# EAGLE design cec-wifi-bridge-rev-a (EAGLE 7.3.0)

## Sheet 1 of 4
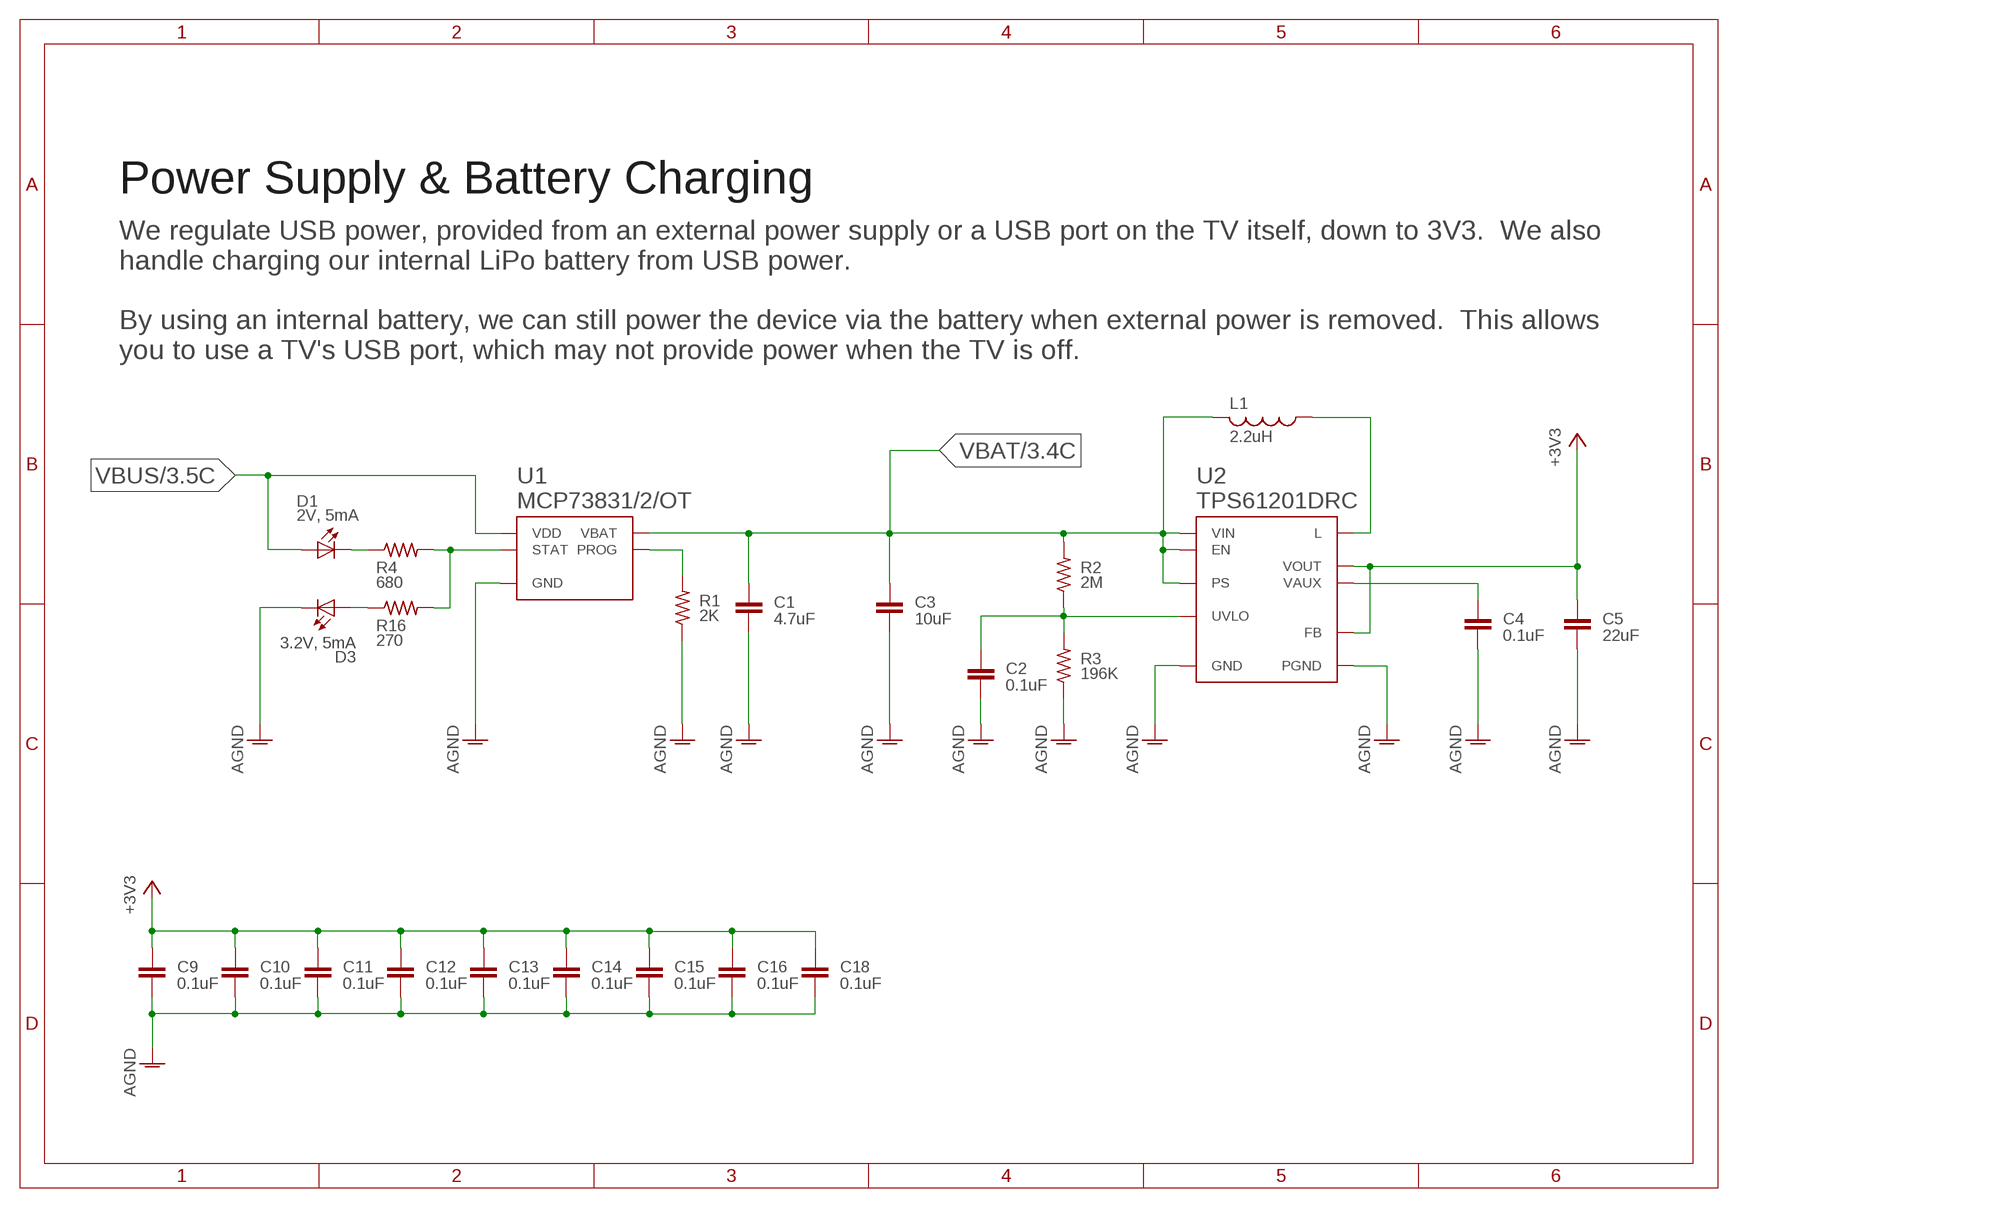
[diagram p0: schematic, sheet 1]
SHEET1 (A4L-NODOC): BOM: EXCLUDE

### Parts
C1  4.7uF  CAPACITOR-0603  [C0603]
C2  0.1uF  CAPACITOR-0402  [C0402]
C3  10uF  CAPACITOR-0805  [C0805]
C4  0.1uF  CAPACITOR-0402  [C0402]
C5  22uF  CAPACITOR-0805  [C0805]
C9  0.1uF  CAPACITOR-0402  [C0402]
C10  0.1uF  CAPACITOR-0402  [C0402]
C11  0.1uF  CAPACITOR-0402  [C0402]
C12  0.1uF  CAPACITOR-0402  [C0402]
C13  0.1uF  CAPACITOR-0402  [C0402]
C14  0.1uF  CAPACITOR-0402  [C0402]
C15  0.1uF  CAPACITOR-0402  [C0402]
C16  0.1uF  CAPACITOR-0402  [C0402]
C18  0.1uF  CAPACITOR-0402  [C0402]
D1  2V, 5mA  DIALIGHT-598-MICROSMD-0603  [DIALIGHT-0603]
D3  3.2V, 5mA  DIALIGHT-598-MICROSMD-0603  [DIALIGHT-0603]
L1  2.2uH  INDUCTOR-HORIZONTAL-XPL2010  [COILCRAFT-XPL2010]
R1  2K  RESISTOR-0402  [R0402]
R2  2M  RESISTOR-0402  [R0402]
R3  196K  RESISTOR-0402  [R0402]
R4  680  RESISTOR-HORIZONTAL-0603  [R0603]
R16  270  RESISTOR-HORIZONTAL-0603  [R0603]
U1  MCP73831/2/OT  [5-SOT23]
U2  TPS61201DRC  TPS61200DRC  [S-PVSON-N10-DRC]

### Nets
+3V3: C5.1 C9.1 C10.1 C11.1 C12.1 C13.1 C14.1 C15.1 C16.1 C18.1 U2.P$2(VOUT) U2.P$10(FB) ; also sheet 2,3,4
AGND: C1.2 C2.2 C3.2 C4.2 C5.2 C9.2 C10.2 C11.2 C12.2 C13.2 C14.2 C15.2 C16.2 C18.2 D3.2(C) R1.1 R3.1 U1.2(GND) U2.GND-VIA-1(PGND) U2.GND-VIA-2(PGND) U2.GND-VIA-3(PGND) U2.GND-VIA-4(PGND) U2.GND-VIA-5(PGND) U2.P$4(PGND) U2.P$9(GND) U2.THERMAL1(PGND) U2.THERMAL2(PGND) U2.THERMAL3(PGND) U2.THERMAL4(PGND) U2.THERMAL(PGND) ; also sheet 2,3,4
N$2: C4.1 U2.P$1(VAUX)
N$4: R1.2 U1.5(PROG)
N$5: D3.1(A) R16.1
N$6: C2.1 R2.1 R3.2 U2.P$7(UVLO)
N$7: R4.2 R16.2 U1.1(STAT)
N$8: D1.2(C) R4.1
N$9: L1.P$1 U2.P$3(L)
VBAT: C1.1 C3.1 L1.P$2 R2.2 U1.3(VBAT) U2.P$5(VIN) U2.P$6(EN) U2.P$8(PS) ; also sheet 3
VBUS: D1.1(A) U1.4(VDD) ; also sheet 3

### Notes on the sheet
- Power Supply & Battery Charging
- We regulate USB power, provided from an external power supply or a USB port on the TV itself, down to 3V3.  We also
  handle charging our internal LiPo battery from USB power.
  
  By using an internal battery, we can still power the device via the battery when external power is removed.  This allows
  you to use a TV's USB port, which may not provide power when the TV is off.

## Sheet 2 of 4
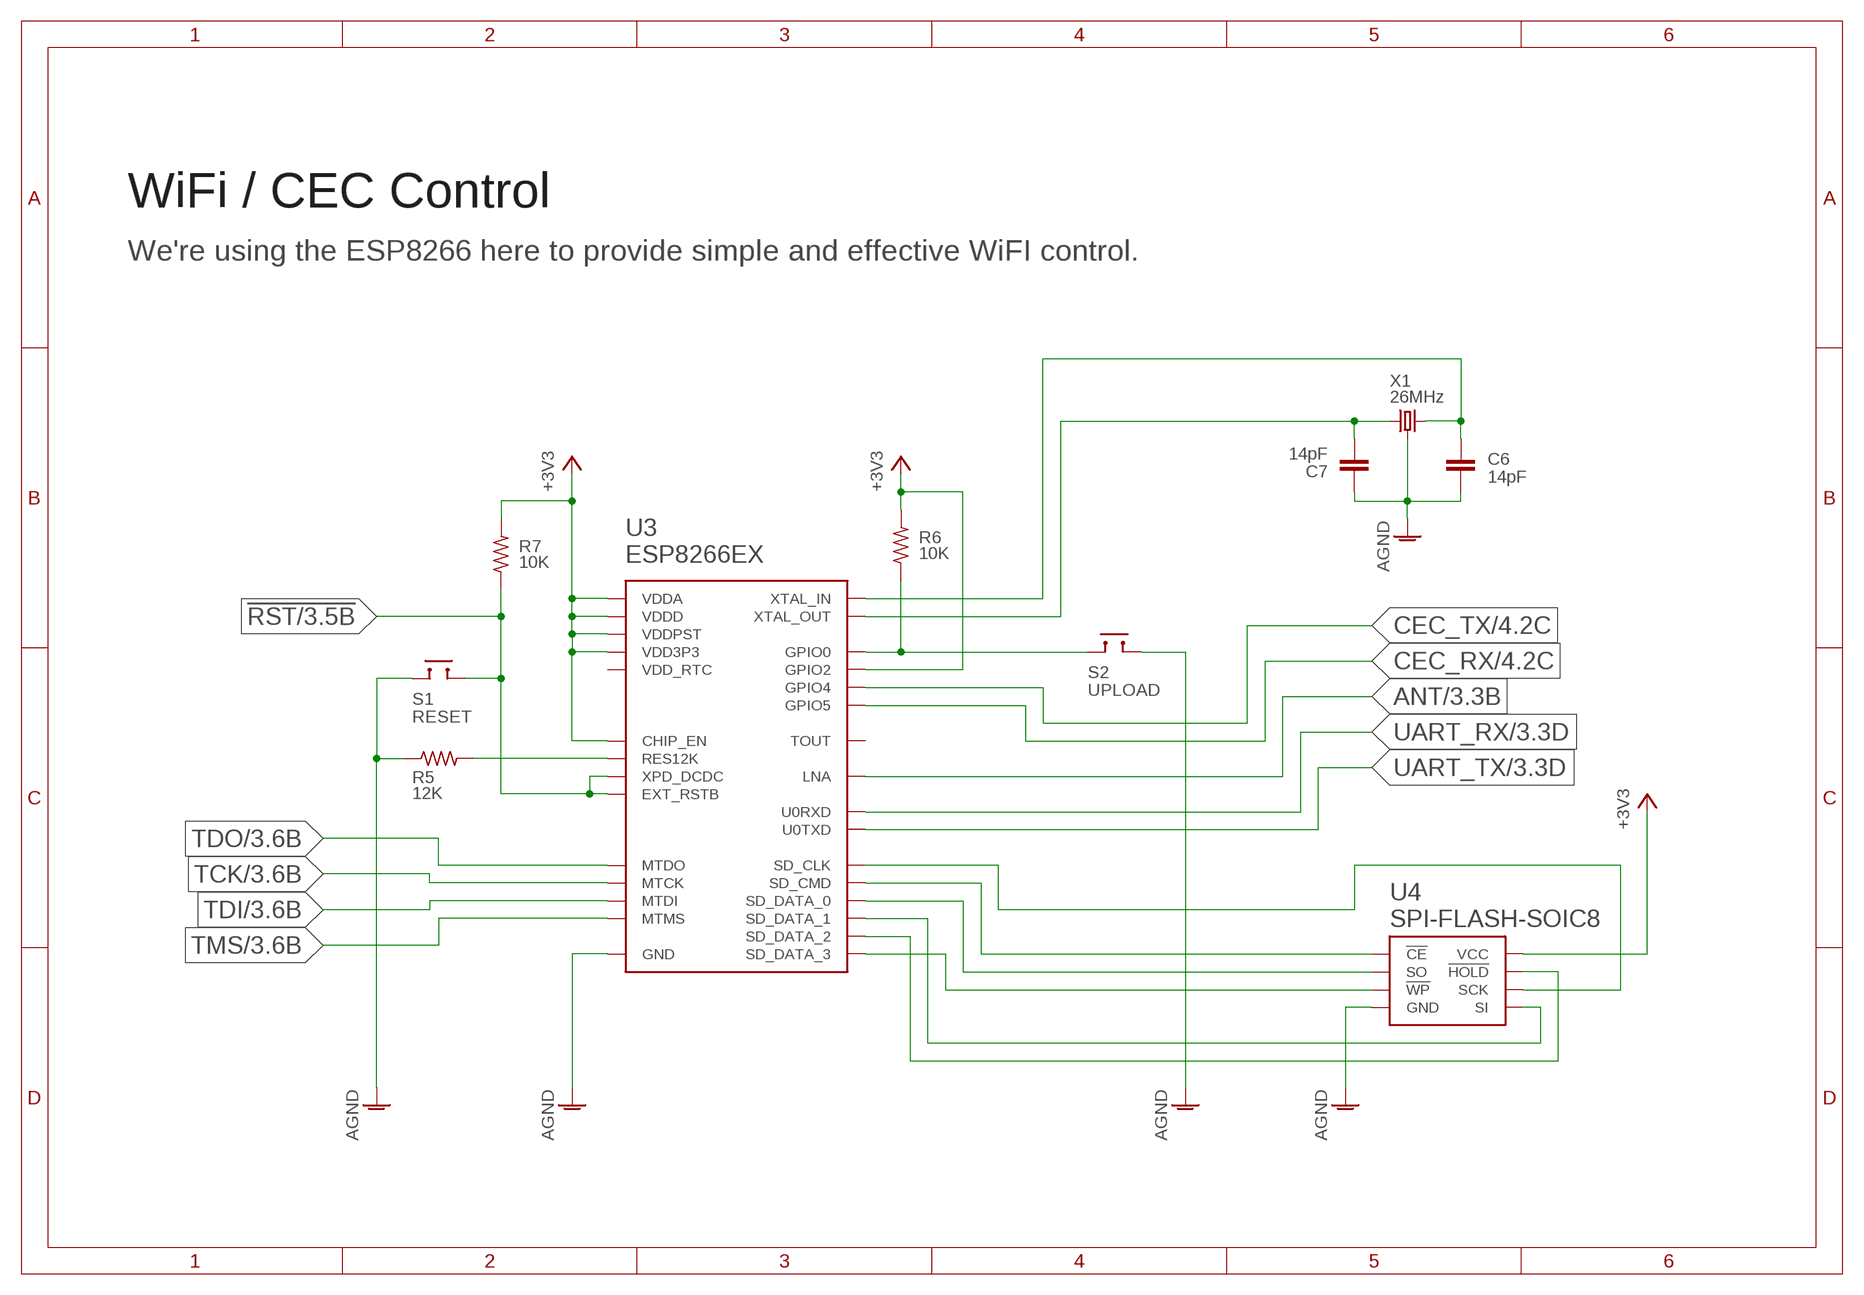
[diagram p1: schematic, sheet 2]
SHEET2 (A4L-NODOC): BOM: EXCLUDE

### Parts
C6  14pF  CAPACITOR-0402  [C0402]
C7  14pF  CAPACITOR-0402  [C0402]
R5  12K  RESISTOR-HORIZONTAL-0402  [R0402]
R6  10K  RESISTOR-0402  [R0402]
R7  10K  RESISTOR-0402  [R0402]
S1  RESET  MOMENTARY-ALPS-SKQG  [ALPS-SKQG]
S2  UPLOAD  MOMENTARY-ALPS-SKQG  [ALPS-SKQG]
U3  ESP8266EX  [ESP8266EX]
U4  SPI-FLASH-SOIC8  [SOIC-8]
X1  26MHz  GROUNDED-CRYSTAL-EPSON-TSX-3225  [EPSON-TSX-3225]

### Nets
!RST: R7.1 S1.P$3 S1.P$4 U3.EXT_RSTB U3.XPD_DCDC ; also sheet 3
+3V3: R6.2 R7.2 U3.CHIP_EN U3.GPIO2 U3.VDD3P3 U3.VDD3P3$2(VDD3P3) U3.VDDA U3.VDDA$2(VDDA) U3.VDDD U3.VDDPST U3.VDDPST$2(VDDPST) U4.P$8(VCC) ; also sheet 1,3,4
AGND: C6.2 C7.1 R5.1 S1.P$1 S1.P$2 S2.P$3 S2.P$4 U3.GND U3.P$1(GND) U3.P$2(GND) U3.P$3(GND) U3.P$4(GND) U3.P$5(GND) U3.P$6(GND) U3.P$7(GND) U3.P$8(GND) U3.P$9(GND) U4.P$4(GND) X1.P$2(GND) X1.P$4(GND) ; also sheet 1,3,4
ANT: U3.LNA ; also sheet 3
CEC_RX: U3.GPOIO5(GPIO5) ; also sheet 4
CEC_TX: U3.GPIO4 ; also sheet 4
FLASH_BOOT: R6.1 S2.P$1 S2.P$2 U3.GPIO0
N$10: R5.2 U3.RES12K
N$11: C6.1 U3.XTAL_IN X1.P$3
N$12: C7.2 U3.XTAL_OUT X1.P$1
N$20: U3.SD_CLK U4.P$6(SCK)
N$21: U3.SD_CMD U4.P$1(!CE)
N$22: U3.SD_DATA_1 U4.P$5(SI)
N$23: U3.SD_DATA_0 U4.P$2(SO)
N$24: U3.SD_DATA_3 U4.P$3(!WP)
N$25: U3.SD_DATA_2 U4.P$7(!HOLD)
TCK: U3.MTCK ; also sheet 3
TDI: U3.MTDI ; also sheet 3
TDO: U3.MTDO ; also sheet 3
TMS: U3.MTMS ; also sheet 3
UART_RX: U3.U0RXD ; also sheet 3
UART_TX: U3.U0TXD ; also sheet 3
Unconnected: U3.TOUT U3.VDD_RTC

### Notes on the sheet
- WiFi / CEC Control
- We're using the ESP8266 here to provide simple and effective WiFI control.

## Sheet 3 of 4
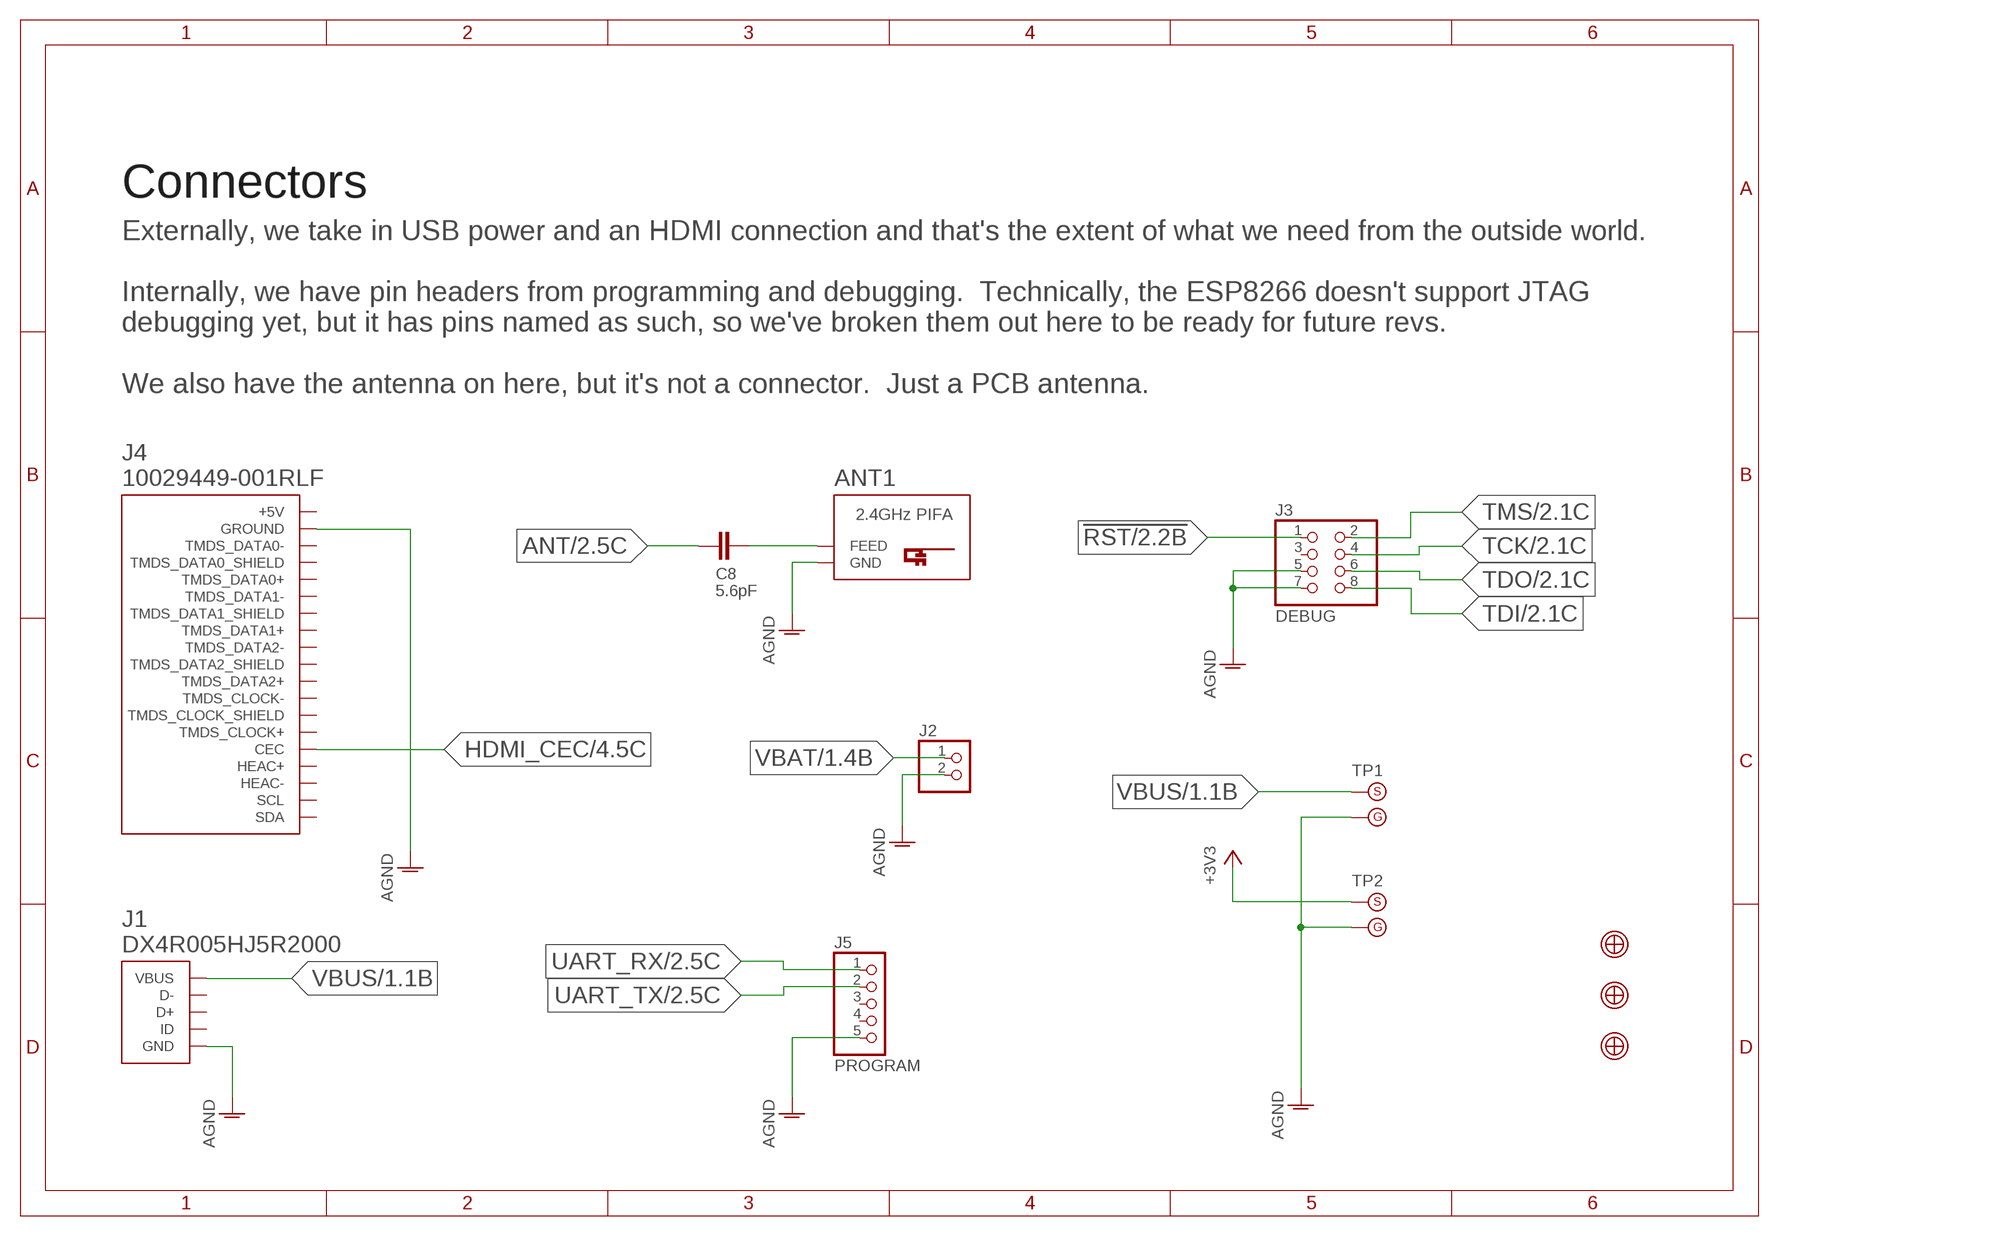
[diagram p2: schematic, sheet 3]
SHEET3 (A4L-NODOC): BOM: EXCLUDE

### Parts
ANT1  INVERTED_F_ANTENNA+0  [DN007+0]
C8  5.6pF  CAPACITOR-HORIZONTAL-0402  [C0402]
J1  DX4R005HJ5R2000  [DX4R005HJ5R2000]
J2  PINHD-1X2  [1X02]
J3  DEBUG  PINHD-2X4  [2X04]
J4  10029449-001RLF  [10029449]
J5  PROGRAM  PINHD-1X5  [1X05]
TP1  TESTPOINT-WITH-GND  [TESTPOINT-1.5-WITH-GND]
TP2  TESTPOINT-WITH-GND  [TESTPOINT-1.5-WITH-GND]
U$1  FIDUCIAL-1MM  [FIDUCIAL_1MM]
U$2  FIDUCIAL-1MM  [FIDUCIAL_1MM]
U$3  FIDUCIAL-1MM  [FIDUCIAL_1MM]

### Nets
!RST: J3.1 ; also sheet 2
+3V3: TP2.S ; also sheet 1,2,4
AGND: ANT1.GND ANT1.GND@1(GND) J1.5(GND) J1.CASE_1(GND) J1.CASE_2(GND) J1.CASE_3(GND) J1.CASE_4(GND) J2.2 J3.5 J3.7 J4.P$17(GROUND) J5.5 TP1.G TP2.G ; also sheet 1,2,4
ANT: C8.1 ; also sheet 2
HDMI_CEC: J4.P$13(CEC) ; also sheet 4
N$26: ANT1.FEED C8.2
TCK: J3.4 ; also sheet 2
TDI: J3.8 ; also sheet 2
TDO: J3.6 ; also sheet 2
TMS: J3.2 ; also sheet 2
UART_RX: J5.1 ; also sheet 2
UART_TX: J5.2 ; also sheet 2
VBAT: J2.1 ; also sheet 1
VBUS: J1.1(VBUS) TP1.S ; also sheet 1
Unconnected: J1.2(D-) J1.3(D+) J1.4(ID) J3.3 J4.P$1(TMDS_DATA2+) J4.P$2(TMDS_DATA2_SHIELD) J4.P$3(TMDS_DATA2-) J4.P$4(TMDS_DATA1+) J4.P$5(TMDS_DATA1_SHIELD) J4.P$6(TMDS_DATA1-) J4.P$7(TMDS_DATA0+) J4.P$8(TMDS_DATA0_SHIELD) J4.P$9(TMDS_DATA0-) J4.P$10(TMDS_CLOCK+) J4.P$11(TMDS_CLOCK_SHIELD) J4.P$12(TMDS_CLOCK-) J4.P$14(HEAC+) J4.P$15(SCL) J4.P$16(SDA) J4.P$18(+5V) J4.P$19(HEAC-) J5.3 J5.4

### Notes on the sheet
- Connectors
- Externally, we take in USB power and an HDMI connection and that's the extent of what we need from the outside world.
  
  Internally, we have pin headers from programming and debugging.  Technically, the ESP8266 doesn't support JTAG
  debugging yet, but it has pins named as such, so we've broken them out here to be ready for future revs.
  
  We also have the antenna on here, but it's not a connector.  Just a PCB antenna.

## Sheet 4 of 4
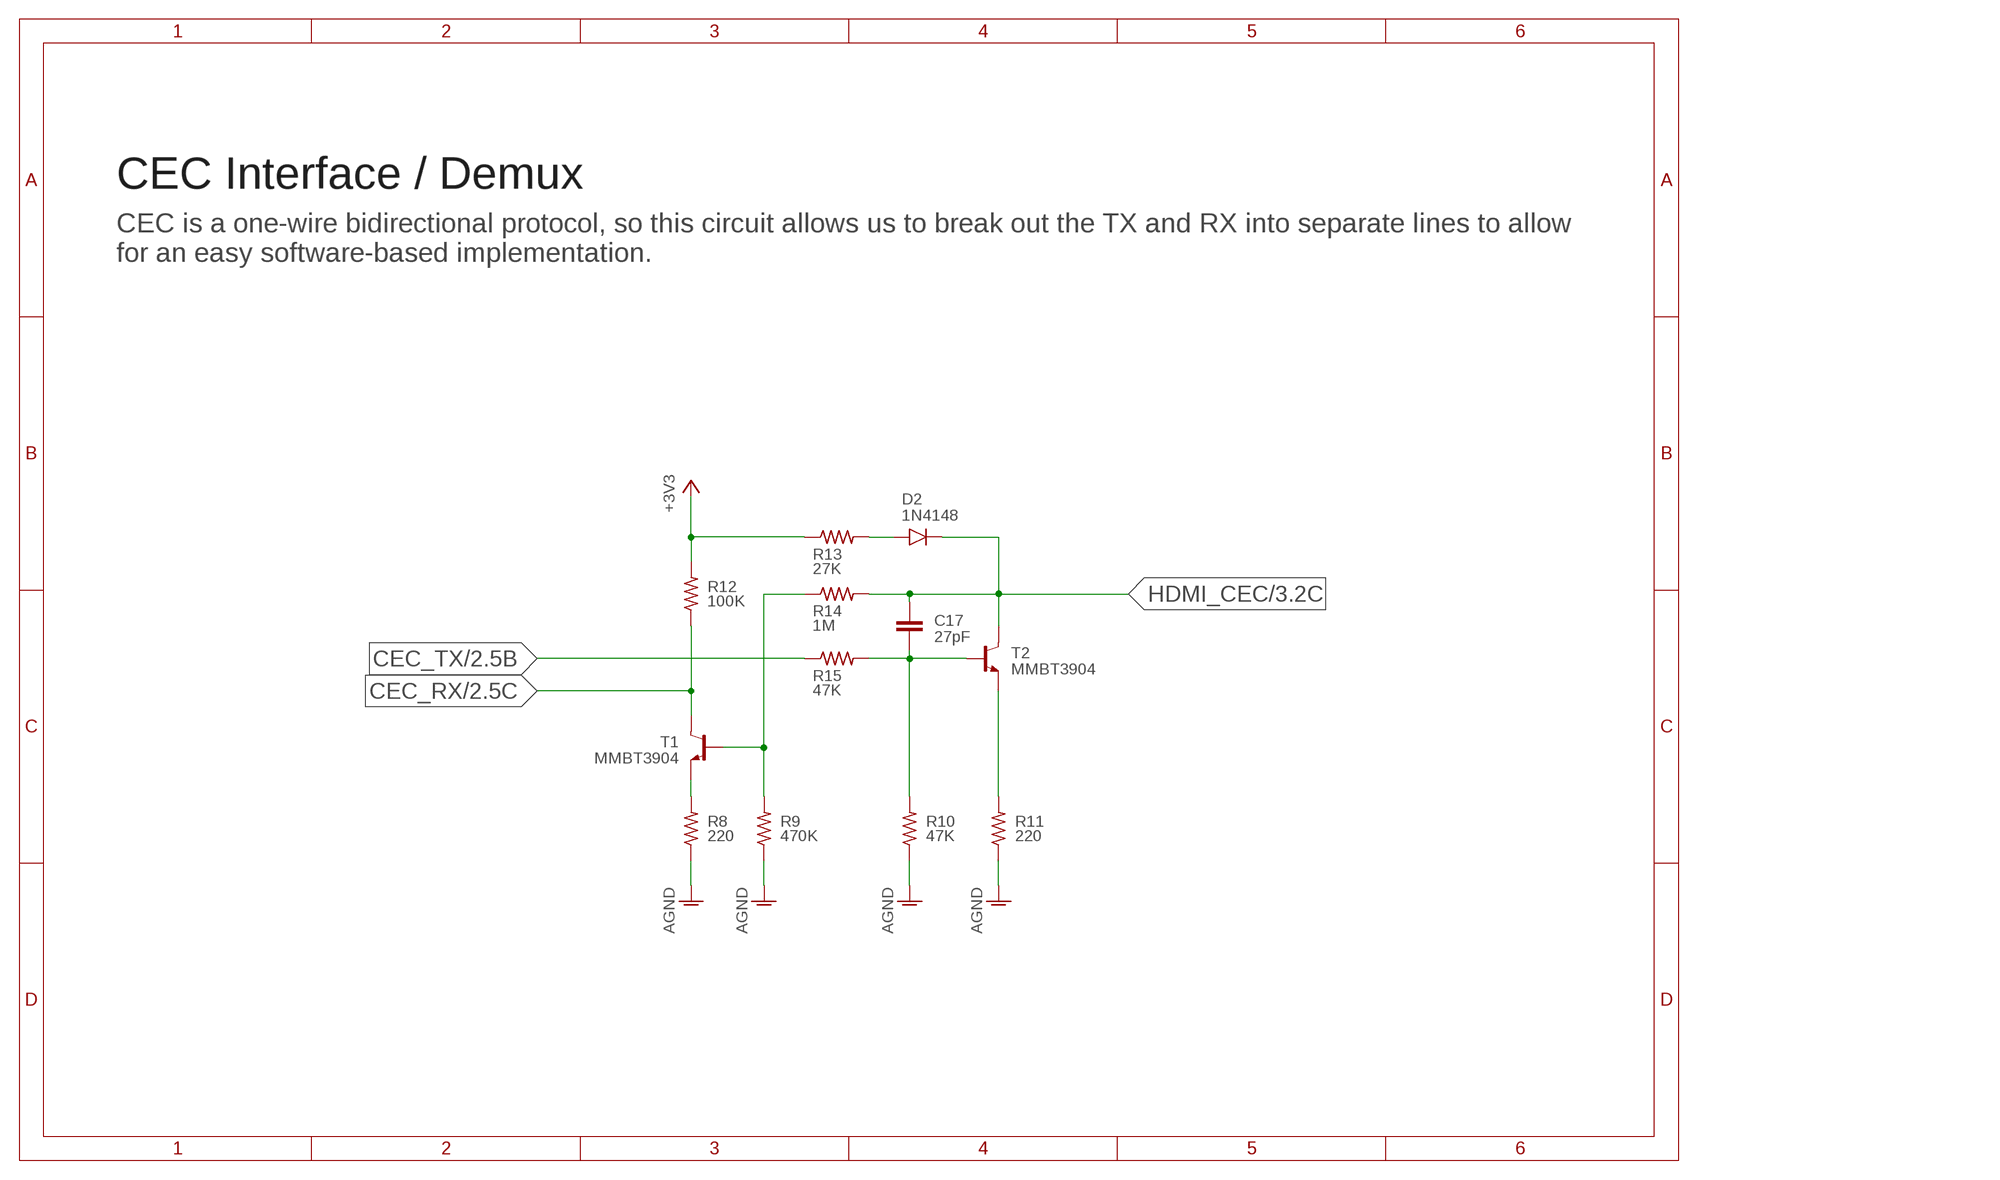
[diagram p3: schematic, sheet 4]
SHEET4 (A4L-NODOC): BOM: EXCLUDE

### Parts
C17  27pF  CAPACITOR-0402  [C0402]
D2  1N4148  DIODE-SOD123  [SOD123]
R8  220  RESISTOR-0402  [R0402]
R9  470K  RESISTOR-0402  [R0402]
R10  47K  RESISTOR-0402  [R0402]
R11  220  RESISTOR-0402  [R0402]
R12  100K  RESISTOR-0402  [R0402]
R13  27K  RESISTOR-HORIZONTAL-0402  [R0402]
R14  1M  RESISTOR-HORIZONTAL-0402  [R0402]
R15  47K  RESISTOR-HORIZONTAL-0402  [R0402]
T1  MMBT3904  BJT-NPN-SOT-23  [SOT-23]
T2  MMBT3904  BJT-NPN-SOT-23  [SOT-23]

### Nets
+3V3: R12.2 R13.1 ; also sheet 1,2,3
AGND: R8.1 R9.1 R10.1 R11.1 ; also sheet 1,2,3
CEC_RX: R12.1 T1.P$3(C) ; also sheet 2
CEC_TX: R15.1 ; also sheet 2
HDMI_CEC: C17.1 D2.C R14.2 T2.P$3(C) ; also sheet 3
N$3: C17.2 R10.2 R15.2 T2.P$1(B)
N$15: R8.2 T1.P$2(E)
N$16: R9.2 R14.1 T1.P$1(B)
N$18: D2.A R13.2
N$27: R11.2 T2.P$2(E)

### Notes on the sheet
- CEC Interface / Demux
- CEC is a one-wire bidirectional protocol, so this circuit allows us to break out the TX and RX into separate lines to allow
  for an easy software-based implementation.

## Library data of the parts
ANT1 = antenna:INVERTED_F_ANTENNA: 2.4GHz Inverted F Antenna Based on TI Design Note DN007; BOM: EXCLUDE
C1 = passives:CAPACITOR: Capacitor; PN: GRM188R61A475KE15D
C2 C4 C9-C16 C18 = passives:CAPACITOR: Capacitor; PN: GRM155R71H104KE14D
C3 = passives:CAPACITOR: Capacitor; PN: GRM21BR61A106KE19L
C5 = passives:CAPACITOR: Capacitor; PN: GRM21BR61A226ME51L
C6 C7 = passives:CAPACITOR: Capacitor; PN: GJM1555C1H140GB01D
C8 = passives:CAPACITOR-HORIZONTAL: Capacitor, horizontal; PN: GJM1555C1H5R6WB01D
C17 = passives:CAPACITOR: Capacitor; PN: GRM1555C1H270GA01D
D1 = dialight:DIALIGHT-598-MICROSMD; PN: APT1608SURCK
D2 = diodes:DIODE-: DIODE; PN: 1N4148W-7-F
D3 = dialight:DIALIGHT-598-MICROSMD; PN: 150060GS75000
J1 = jae:DX4R005HJ5R2000: USB Micro-B; PN: DX4R005HJ5R2000
J2 = pin-headers:PINHD-1X2: PIN HEADER; BOM: EXCLUDE
J3 = pin-headers:PINHD-2X4: PIN HEADER; PN: M20-9760446
J4 = amphenol:10029449: HDMI Type A Receptacle; PN: 10029449-001RLF
J5 = pin-headers:PINHD-1X5: PIN HEADER; PN: M20-9990546
L1 = passives:INDUCTOR-HORIZONTAL: INDUCTOR, American symbol; PN: XPL2010-222MLB
R1 = passives:RESISTOR; PN: RC0402FR-072KL
R2 = passives:RESISTOR; PN: RC0402FR-072ML
R3 = passives:RESISTOR; PN: RC0402FR-07196KL
R4 = passives:RESISTOR-HORIZONTAL; PN: RC0603FR-07680RL
R5 = passives:RESISTOR-HORIZONTAL; PN: RC0402FR-0712KL
R6 R7 = passives:RESISTOR; PN: RC0402FR-0710KL
R8 R11 = passives:RESISTOR; PN: RC0402FR-07220RL
R9 = passives:RESISTOR; PN: RC0402FR-07470KL
R10 = passives:RESISTOR; PN: RC0402FR-0747KL
R12 = passives:RESISTOR; PN: RC0402FR-07100KL
R13 = passives:RESISTOR-HORIZONTAL; PN: ERJ-2RKF2702X
R14 = passives:RESISTOR-HORIZONTAL; PN: RC0402FR-071ML
R15 = passives:RESISTOR-HORIZONTAL; PN: RC0402FR-0747KL
R16 = passives:RESISTOR-HORIZONTAL; PN: RC0603FR-07270RL
S1 S2 = switches:MOMENTARY; PN: SKQGADE010
T1 T2 = transistors:BJT-NPN; PN: MMBT3904LT1G
TP1 TP2 = test:TESTPOINT-WITH-GND; BOM: EXCLUDE
U1 = microchip:MCP73831/2: Miniature Single-Cell, Fully Integrated Li-Ion, Li-Polymer Charge Management Controllers; PN: MCP73831T-2ACI/OT
U2 = texas-instruments:TPS6120: LOW INPUT VOLTAGE SYNCHRONOUS BOOST CONVERTER WITH 1.3-A SWITCHES; PN: TPS61201DRCR
U3 = espressif:ESP8266EX; PN: ESP8266EX
U4 = flash:SPI-FLASH; PN: S25FL116K0XMFI041
U$1-U$3 = fiducials:FIDUCIAL: Fidicual Mark Used by pick-and-place machines to align and orient boards before loading components.; BOM: EXCLUDE
X1 = crystals:GROUNDED-CRYSTAL; PN: TSX-3225 26.0000MF09Z-AC3

## Board
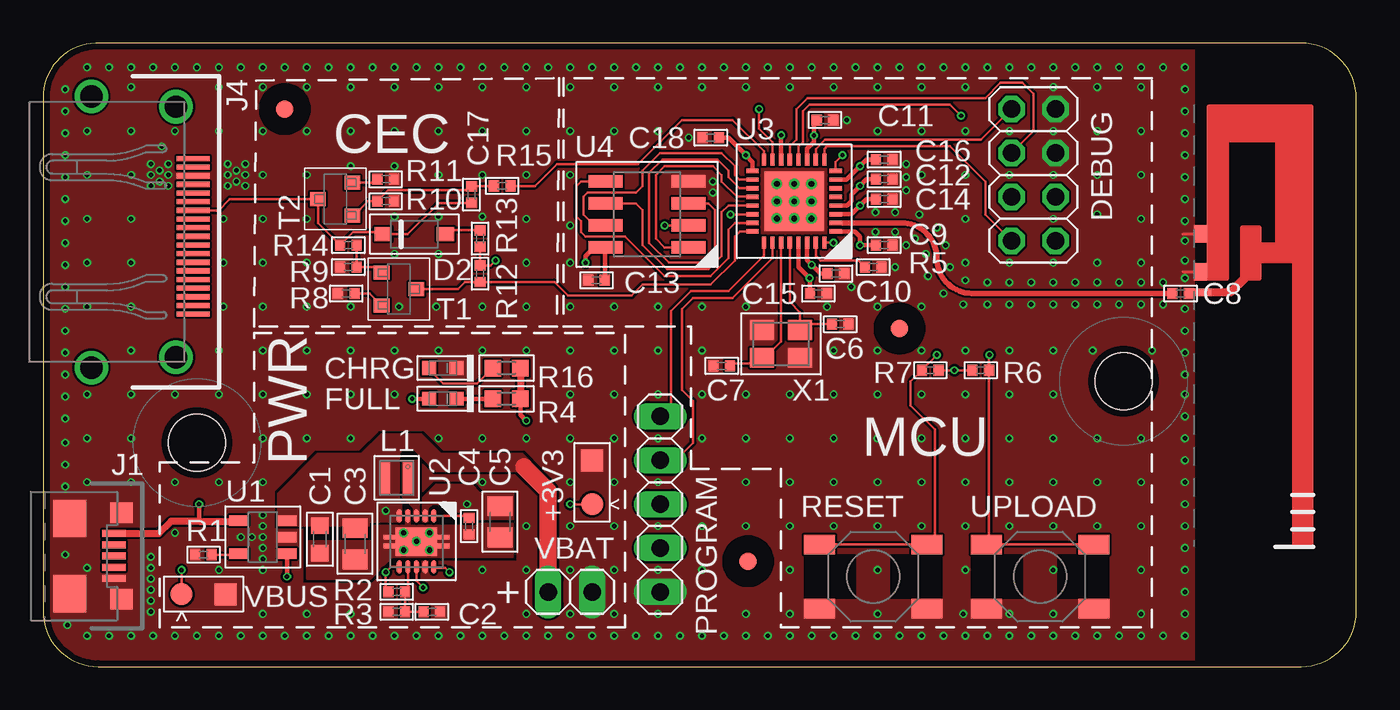
[diagram p4: board, top side]
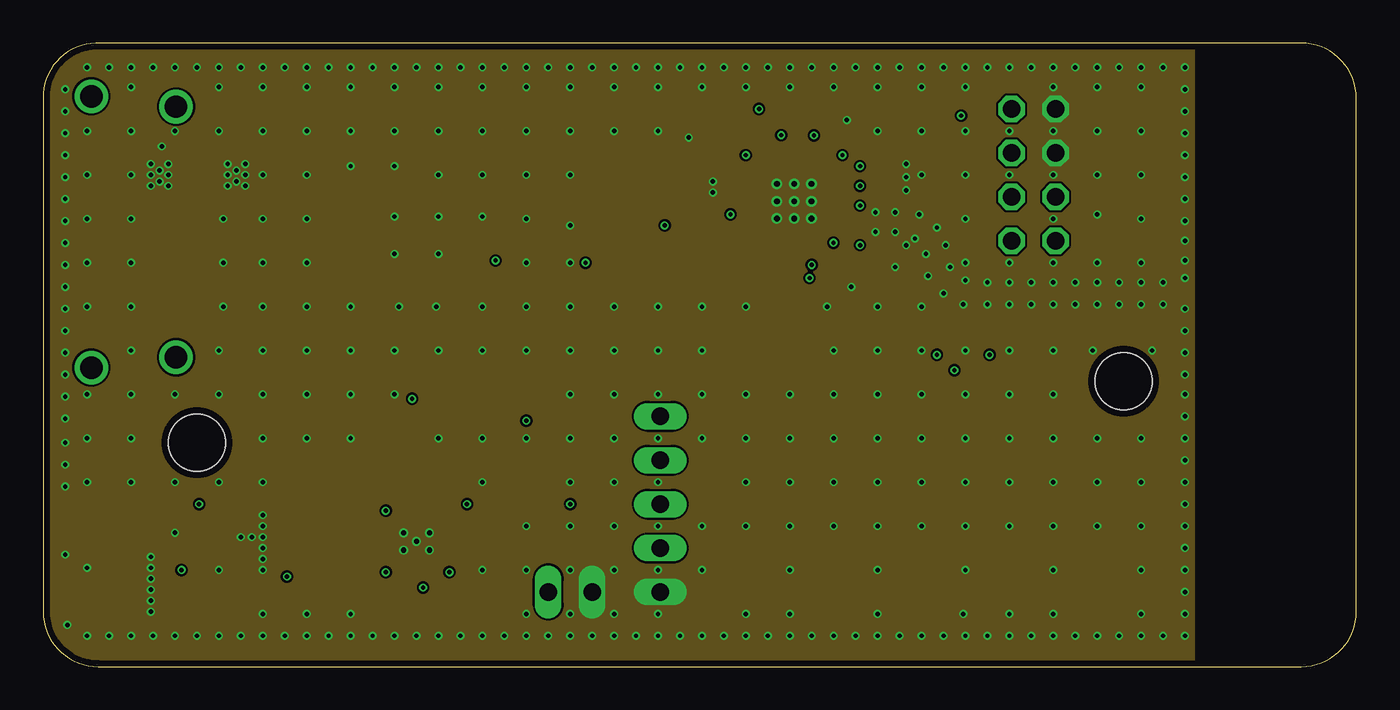
[diagram p5: board, inner layer Route2]
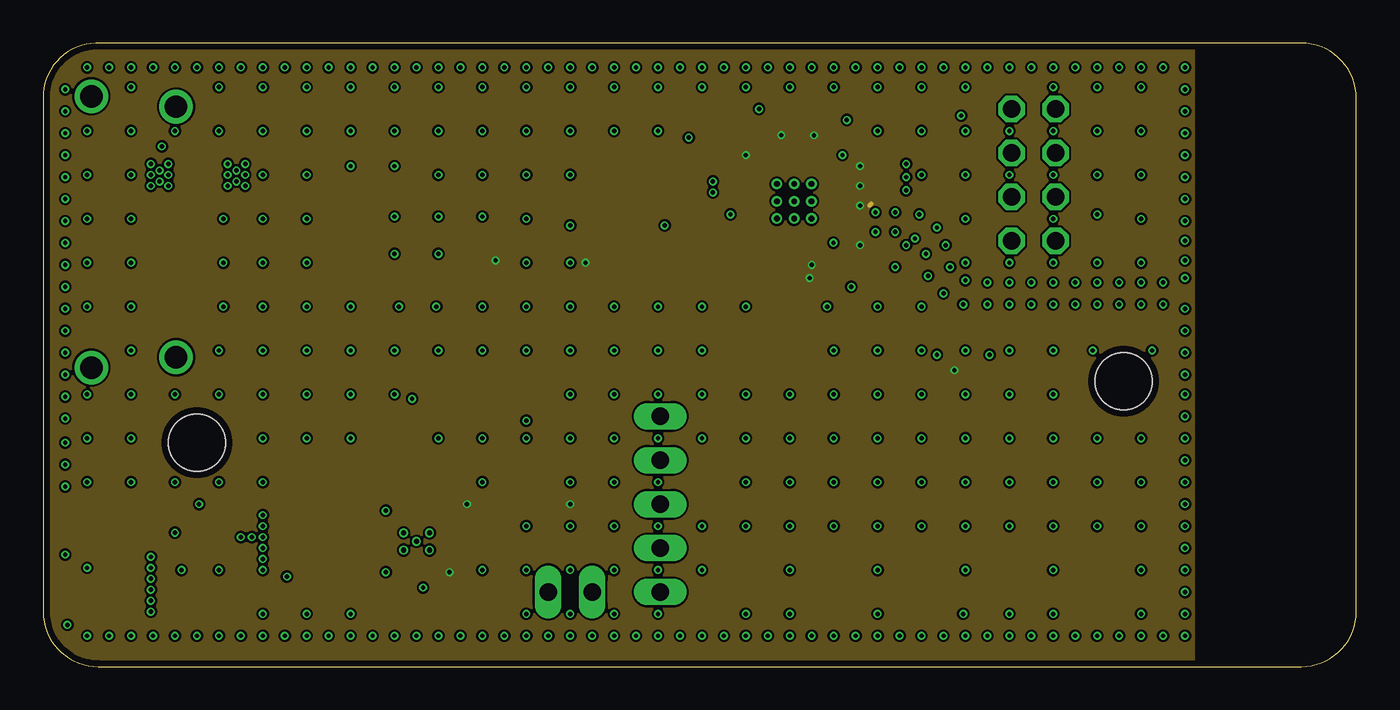
[diagram p6: board, inner layer Route15]
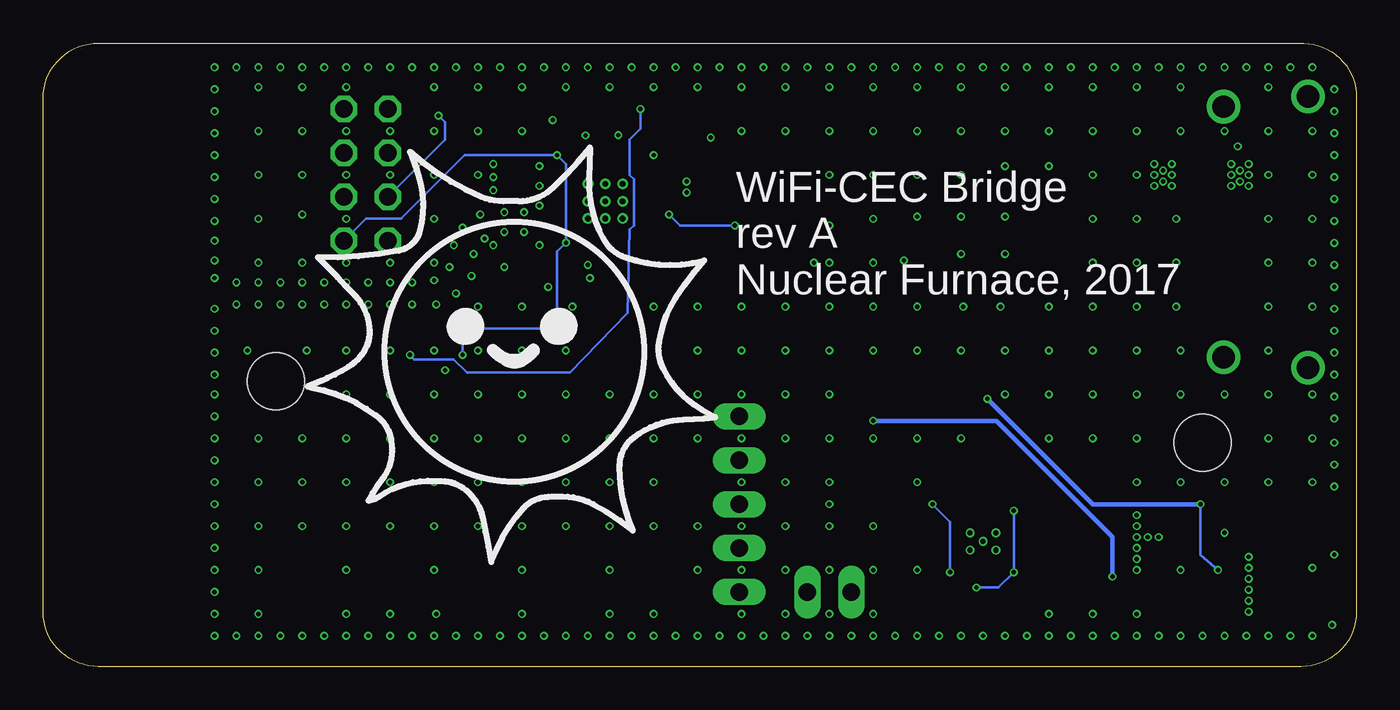
[diagram p7: board, bottom side, seen from below]

Size 75.95 x 36.07 mm. Coordinates in mm from the lower left corner, seen from the top.
Outline: 0,32.89 0,3.17 arc90 3.17,0 72.77,0 arc90 75.95,3.17 75.95,32.89 arc90 72.77,36.07 3.05,36.07 arc90 0,32.89
Copper layers (1*2*15*16): Top 0.035559375mm / dielectric 0.17018125mm / Route2 0.01778125mm / dielectric 47mil / Route15 0.01778125mm / dielectric 0.17018125mm / Bottom 0.035559375mm
Design rules "OSHPark-4Layer": minimum track width 5mil, minimum drill 10mil, track to track 5mil, track to pad 5mil, pad to pad 5mil, via to via 5mil, smd to smd 5mil, copper to edge 15mil, drill to drill 6mil, minimum pad ring 4mil, minimum via ring 4mil, stop-mask expansion 2.5mil, vias tented up to drill 11mil, thermal gap 10mil
Holes 3.3 mm at 8.89,12.95 62.48,16.51

### Footprints (pad centres in the part's own frame; a part is rotated, then mirrored left to right if it is on the bottom)
DN007+0 = smd 0.46 x 1: FEED 2.22,-2.8 | smd 1.01 x 0.74: GND -1.16,-2.93; GND@1 1.035,-2.93
C0603 = smd 0.95 x 1: 1 -0.8,0; 2 0.8,0
C0402 = smd 0.59 x 0.64: 1 -0.48,0; 2 0.48,0
C0805 = smd 1.15 x 1.45: 1 -0.9,0; 2 0.9,0
DIALIGHT-0603 = smd 0.8 x 0.8: 1 -0.8,0; 2 0.8,0
SOD123 = smd 1 x 0.8: A 1.8,0; C -1.8,0
DX4R005HJ5R2000 = smd 0.4 x 1.35: 1 -1.3,2.575; 2 -0.65,2.575; 3 0,2.575; 4 0.65,2.575; 5 1.3,2.575 | smd 2.15 x 1.9: CASE_1 -2.175,0; CASE_2 2.175,0 | smd 1.2 x 1.3: CASE_3 -2.5,3; CASE_4 2.5,3
1X02 = drill 1.016 long: 1 -1.27,0; 2 1.27,0
2X04 = drill 1.016 octagon: 1 -3.81,-1.27; 2 -3.81,1.27; 3 -1.27,-1.27; 4 -1.27,1.27; 5 1.27,-1.27; 6 1.27,1.27; 7 3.81,-1.27; 8 3.81,1.27
10029449 = smd 0.3 x 1.9: P$1 4.75,5; P$2 4.25,5; P$3 3.75,5; P$4 3.25,5; P$5 2.75,5; P$6 2.25,5; P$7 1.75,5; P$8 1.25,5; P$9 0.75,5; P$10 0.25,5; P$11 -0.25,5; P$12 -0.75,5; P$13 -1.25,5; P$14 -1.75,5; P$15 -2.25,5; P$16 -2.75,5; P$17 -3.25,5; P$18 -3.75,5; P$19 -4.25,5 | drill 1.3: P$20 -7.25,4; P$21 7.25,4; P$22 -7.85,-0.9; P$23 7.85,-0.9
1X05 = drill 1.016 long: 1 -5.08,0; 2 -2.54,0; 3 0,0; 4 2.54,0; 5 5.08,0
COILCRAFT-XPL2010 = smd 0.6 x 1.8: P$1 -0.675,0; P$2 0.675,0
R0402 = smd 0.59 x 0.64: 1 -0.48,0; 2 0.48,0
R0603 = smd 0.95 x 0.95: 1 -0.8,0; 2 0.8,0
ALPS-SKQG = smd 1.8 x 1.1: P$1 -3.1,1.85; P$2 3.1,1.85; P$3 -3.1,-1.85; P$4 3.1,-1.85
SOT-23 = smd 0.8 x 0.9: P$1 -0.95,-1; P$2 0.95,-1; P$3 0,1
TESTPOINT-1.5-WITH-GND = smd 1.27 x 1.27: G 1.27,0; S -1.27,0
5-SOT23 = smd 0.6 x 1.1: 1 -0.95,-1.4; 2 0,-1.4; 3 0.95,-1.4; 4 0.95,1.4; 5 -0.95,1.4
S-PVSON-N10-DRC = drill 0.3 pad 0.4: GND-VIA-1 -0.75,0.5; GND-VIA-2 0.75,0.5; GND-VIA-3 0,0; GND-VIA-4 -0.75,-0.5; GND-VIA-5 0.75,-0.5 | smd 0.3 x 0.8: P$1 -1,-1.475; P$2 -0.5,-1.475; P$3 0,-1.475; P$4 0.5,-1.475; P$5 1,-1.475; P$6 1,1.475; P$7 0.5,1.475; P$8 0,1.475; P$9 -0.5,1.475; P$10 -1,1.475 | smd 2.4 x 1.65: THERMAL 0,0 | smd 0.7 x 0.28: THERMAL1 -1.55,0.25; THERMAL2 -1.55,-0.25; THERMAL3 1.55,0.25; THERMAL4 1.55,-0.25
ESP8266EX = smd 0.7 x 0.25: CHIP_EN -2.4,-1.25; GPOIO5 2.4,1.75; LNA -2.4,1.25; SD_CLK 2.4,0.25; SD_CMD 2.4,-0.25; SD_DATA_0 2.4,0.75; SD_DATA_1 2.4,1.25; SD_DATA_2 2.4,-1.25; SD_DATA_3 2.4,-0.75; TOUT -2.4,-0.75; VDD3P3 -2.4,0.75; VDD3P3$2 -2.4,0.25; VDD_RTC -2.4,-0.25; VDDA -2.4,1.75; VDDPST$2 2.4,-1.75; XPD_DCDC -2.4,-1.75 | smd 0.25 x 0.7: EXT_RSTB -1.75,2.4; GPIO0 1.25,-2.4; GPIO2 0.75,-2.4; GPIO4 1.75,-2.4; MTCK -0.25,-2.4; MTDI -1.25,-2.4; MTDO 0.25,-2.4; MTMS -1.75,-2.4; RES12K -1.25,2.4; U0RXD 1.75,2.4; U0TXD 1.25,2.4; VDDA$2 -0.75,2.4; VDDD -0.25,2.4; VDDPST -0.75,-2.4; XTAL_IN 0.25,2.4; XTAL_OUT 0.75,2.4 | smd 3.45 x 3.45: GND 0,0 | drill 0.33 pad 0.61: P$1 -1,1; P$2 0,1; P$3 1,1; P$4 1,0; P$5 0,0; P$6 -1,0; P$7 -1,-1; P$8 0,-1; P$9 1,-1
SOIC-8 = smd 0.72 x 1.95: P$1 -1.905,-2.4; P$2 -0.635,-2.4; P$3 0.635,-2.4; P$4 1.905,-2.4; P$5 1.905,2.4; P$6 0.635,2.4; P$7 -0.635,2.4; P$8 -1.905,2.4
FIDUCIAL_1MM = smd 1 x 1: 1 0,0
EPSON-TSX-3225 = smd 1.4 x 1.15: P$1 -1.1,-0.8; P$2 1.1,-0.8; P$3 1.1,0.8; P$4 -1.1,0.8

### Placement (x,y rotation side)
ANT1  69.85,23.88 270 top
C1  16,7.37 270 top
C2  22.48,3.17 0 top
C3  18.03,7.11 270 top
C4  24.64,8.13 270 top
C5  26.42,8.38 270 top
C6  46.1,19.81 0 top
C7  39.24,17.4 0 top
C8  65.79,21.59 0 top
C9  48.64,24.38 0 top
C10  45.85,22.73 0 top
C11  45.21,31.62 0 top
C12  48.64,28.19 0 top
C13  32,22.35 180 top
C14  48.64,27.05 0 top
C15  44.83,21.59 0 top
C16  48.64,29.34 0 top
C17  24.77,27.3 90 top
C18  38.61,30.61 180 top
D1  23.11,15.49 0 top
D2  21.46,25.02 0 top
D3  23.11,17.27 0 top
J1  1.52,6.4 270 top
J2  30.48,4.32 0 top
J3  57.28,28.45 90 top
J4  3.68,25.15 270 top
J5  35.69,9.4 270 top
L1  20.45,10.92 180 top
R1  9.27,6.48 0 top
R2  20.45,4.32 180 top
R3  20.45,3.17 0 top
R4  26.8,15.49 0 top
R5  48.01,23.11 180 top
R6  54.23,17.14 180 top
R7  51.31,17.14 0 top
R8  17.53,21.59 0 top
R9  17.65,23.11 0 top
R10  19.81,26.92 180 top
R11  19.81,28.19 180 top
R12  25.27,22.73 90 top
R13  25.27,24.77 90 top
R14  17.65,24.38 180 top
R15  26.54,27.81 180 top
R16  26.8,17.27 0 top
S1  48.01,5.21 180 top
S2  57.66,5.21 0 top
T1  20.57,21.84 270 top
T2  16.89,27.05 90 top
TP1  9.27,4.19 0 top
TP2  31.75,10.67 90 top
U1  12.7,7.49 90 top
U2  21.59,7.24 180 top
U3  43.43,26.92 180 top
U4  34.92,26.16 90 top
U$1  13.97,32.26 0 top
U$2  49.53,19.56 0 top
U$3  40.77,6.1 0 top
X1  42.67,18.67 0 top

### Tracks (layer width: path | path; a pad name or v marks a point on that pad's centre or on a via)
!RST  (via drill 0.25)
  Top 0.152: U3.XPD_DCDC 45.83,29.2 v46.23,29.59 | S1.P$4 S1.P$3 | 50.83,7.33 50.93,7.49 50.93,6.73 51.56,7.37 51.56,13.72 50.16,15.11 50.16,16.48 R7.1 50.67,17.05 50.7,17.05 v51.69,18.03 | v45.71,24.52 U3.EXT_RSTB
  Top 0.254: 50.83,7.33 S1.P$3
  Bottom 0.152: v51.69,18.03 51.69,19.05 51.18,19.56 46.74,19.56 46.23,20.07 46.23,24 v45.71,24.52 45.71,29.07 v46.23,29.59 51.56,29.59 55.24,25.91 57.28,25.91 J3.1
+3V3  (via drill 0.25)
  Top 0.152: 22.59,5.95 U2.P$10 22.59,5.73 22.61,5.71 23.24,5.71 v23.5,5.46 | R7.2 v52.7,17.14 R6.2 | TP2.S v30.48,9.4 | v26.16,23.5 25.88,23.21 R12.2 R13.1
  Top 0.254: C13.1 32.48,24.22 | 32.48,24.22 U4.P$8 | U3.VDDD 43.68,23.12 v44.32,22.48 44.35,22.45 C15.1 | U3.VDDA$2 44.18,23.51 v44.45,23.24 44.96,22.73 C10.1 | U3.VDDA 46.96,25.17 47.24,24.89 v47.24,24.38 C9.1 | U3.VDD3P3 46.75,26.17 v47.24,26.67 47.62,27.05 C14.1 | U3.VDD3P3$2 46.49,26.67 46.74,26.92 46.74,27.3 v47.24,27.81 47.62,28.19 C12.1 | U3.CHIP_EN 46.46,28.17 v47.24,28.96 47.62,29.34 C16.1 | U3.GPIO2 v42.68,30.75 | U3.VDDPST 44.18,29.96 44.58,30.35 v44.58,30.73 44.58,31.47 C11.1 | U3.VDDPST$2 41.03,29.2 v40.64,29.59 39.62,30.61 C18.1 | 32.48,24.22 31.84,24.22 31.37,23.75 v31.37,23.37
  Route15 0.254: 47.78,26.67 47.91,26.8
  Bottom 0.152: v23.5,5.46 23.5,8.38 v24.51,9.4
  pour Route15 (no thermals): 66.55,0 3.17,0 arc-90 0,3.17 0,32.89 arc-90 3.05,36.07 66.55,36.07
  pour Top (isolate 0.127, no thermals): 22.23,9.14 22.23,8.38 21.97,8.38 21.97,9.78 22.73,10.54 24.77,10.54 25.27,10.03 27.18,10.03 27.18,8.51 23.88,8.51 22.99,9.4 22.48,9.4
AGND  (via drill 0.25)
  Top 0.152: 41.25,19.15 X1.P$4 | 44.09,18.19 X1.P$2 | ANT1.GND 65.93,25.04 65.91,25.02 | ANT1.GND@1 65.93,22.84 65.91,22.86
  other vias: 38.73,27.43 38.73,28.07 1.27,28.32 7.24,28.45 1.27,23.24 1.27,19.43 10.67,28.45 57.15,22.23 49.91,29.08 49.91,28.32 50.67,26.16 48.13,25.15 49.28,25.15 50.42,24.77 51.05,23.88 51.18,22.61 52.07,21.59 53.21,20.95 51.69,25.4 52.2,24.38 52.45,23.11 53.34,22.35 54.61,20.95 54.61,22.23 55.88,20.95 57.15,20.95 58.42,20.95 59.69,20.95 60.96,20.95 62.23,20.95 63.5,20.95 64.77,20.95 66.04,20.7 55.88,22.23 58.42,22.23 59.69,22.23 60.96,22.23 62.23,22.23 63.5,22.23 64.77,22.23 66.04,22.48 66.04,24.64 66.04,27.05 66.04,28.32 66.04,29.59 66.04,30.86 66.04,32.13 66.04,33.4 66.04,34.67 64.77,34.67 63.5,34.67 62.23,34.67 60.96,34.67 59.69,34.67 58.42,34.67 57.15,34.67 55.88,34.67 54.61,34.67 53.34,34.67 52.07,34.67 50.8,34.67 49.53,34.67 48.26,34.67 46.99,34.67 45.72,34.67 44.45,34.67 43.18,34.67 41.91,34.67 40.64,34.67 39.37,34.67 38.1,34.67 36.83,34.67 35.56,34.67 34.29,34.67 33.02,34.67 31.75,34.67 30.48,34.67 29.21,34.67 27.94,34.67 26.67,34.67 25.4,34.67 24.13,34.67 22.86,34.67 21.59,34.67 20.32,34.67 19.05,34.67 17.78,34.67 16.51,34.67 15.24,34.67 13.97,34.67 12.7,34.67 11.43,34.67 10.16,34.67 8.89,34.67 7.62,34.67 6.35,34.67 5.08,34.67 3.81,34.67 2.54,34.67 1.27,33.4 1.27,32.13 1.27,30.86 1.27,29.59 1.27,27.05 1.27,25.78 1.27,24.51 1.27,21.97 1.27,20.7 1.27,18.16 1.27,16.89 1.27,6.48 2.54,1.78 3.81,1.78 5.08,1.78 6.35,1.78 7.62,1.78 8.89,1.78 10.16,1.78 11.43,1.78 12.7,1.78 13.97,1.78 15.24,1.78 16.51,1.78 17.78,1.78 19.05,1.78 20.32,1.78 21.59,1.78 22.86,1.78 24.13,1.78 25.4,1.78 26.67,1.78 27.94,1.78 29.21,1.78 30.48,1.78 31.75,1.78 33.02,1.78 34.29,1.78 35.56,1.78 36.83,1.78 38.1,1.78 39.37,1.78 40.64,1.78 41.91,1.78 43.18,1.78 44.45,1.78 45.72,1.78 46.99,1.78 48.26,1.78 49.53,1.78 50.8,1.78 52.07,1.78 53.34,1.78 54.61,1.78 55.88,1.78 57.15,1.78 58.42,1.78 59.69,1.78 60.96,1.78 62.23,1.78 63.5,1.78 64.77,1.78 66.04,1.78 66.04,3.05 66.04,4.32 66.04,5.59 66.04,6.86 66.04,8.13 66.04,9.4 66.04,10.67 66.04,11.94 66.04,16.89 66.04,18.16 66.04,19.43 7.24,29.08 6.22,28.45 10.67,29.08 6.22,27.81 7.24,27.81 6.73,28.7 10.67,27.81 11.68,27.81 11.18,28.07 11.18,28.7 11.68,28.45 11.68,29.08 6.73,28.07 6.22,29.08 6.22,6.35 6.22,3.81 6.22,5.71 6.22,3.17 6.22,5.08 6.22,4.45 12.7,7.49 12.7,8.13 12.7,8.76 12.7,6.86 12.7,6.22 12.06,7.49 11.43,7.49 49.91,27.56 49.91,24.38 49.28,23.11 43.18,33.53 46.48,31.62 66.04,23.5 66.04,25.78 66.04,13.21 66.04,14.48 66.04,15.75 1.27,15.62 1.27,14.35 1.27,12.95 53.34,25.91 48.26,30.99 48.13,26.29 49.28,26.29 1.27,11.68 1.4,2.41 63.5,30.99 63.5,28.45 63.5,25.91 63.5,23.37 60.96,13.21 63.5,10.67 63.5,8.13 63.5,5.59 63.5,3.05 60.96,10.67 55.88,10.67 53.34,10.67 50.8,10.67 48.26,10.67 45.72,10.67 43.18,10.67 40.64,10.67 38.1,8.13 40.64,8.13 38.1,5.59 35.56,3.05 40.64,3.05 48.26,3.05 48.26,5.59 53.34,5.59 53.21,3.05 58.42,3.05 58.42,5.59 53.34,8.13 53.34,13.21 50.8,13.21 45.72,13.21 43.18,13.21 40.64,13.21 38.1,13.21 45.72,15.75 43.18,15.75 48.26,18.29 50.8,15.75 50.8,20.83 48.26,20.83 55.88,13.21 58.42,13.21 55.88,18.29 58.42,15.75 53.34,18.29 58.42,18.29 58.42,30.99 38.1,33.53 35.56,33.53 20.32,30.99 15.24,30.99 15.24,33.53 12.7,33.53 12.7,30.99 15.24,28.45 12.7,25.91 15.24,25.91 12.7,23.37 15.24,23.37 10.16,15.75 12.7,20.83 15.24,18.29 10.16,18.29 15.24,15.75 12.7,15.75 17.78,18.29 17.78,15.75 15.24,20.83 17.78,13.21 15.24,13.21 35.56,10.67 30.48,8.13 33.02,13.21 33.02,15.75 20.32,18.29 20.32,15.75 5.08,13.21 2.54,13.21 5.08,15.75 5.08,18.29 5.08,20.83 2.54,20.83 2.54,23.37 5.08,23.37 5.08,25.91 5.08,28.45 2.54,30.99 6.86,30.1 5.08,10.67 10.16,10.67 12.7,10.67 12.7,5.59 33.02,5.59 33.02,3.05 1.27,10.41 2.54,10.67 43.18,3.05 35.56,8.13 35.56,5.59 35.56,13.21 43.18,8.13 60.96,8.13 58.42,8.13 50.8,8.13 45.72,8.13 40.64,15.75 12.7,13.21 60.96,23.37 60.96,26.16 60.96,28.45 58.42,25.91 58.42,23.37 60.96,30.99 58.42,28.45 55.88,3.05 55.88,8.13 48.26,8.13 43.18,5.59 33.02,8.13 33.02,10.67 35.56,15.75 38.1,15.75 38.1,18.29 38.1,20.83 30.48,13.21 27.94,13.21 25.4,13.21 30.48,10.67 27.94,3.05 27.94,5.59 27.94,8.13 30.48,5.59 30.48,3.05 25.4,10.67 30.48,15.75 33.02,18.29 35.56,18.29 30.48,18.29 25.4,20.83 27.94,20.83 22.73,20.83 12.7,18.29 35.56,20.83 10.41,20.83 10.41,23.37 10.41,25.91 5.08,30.99 7.62,30.99 2.54,5.71 12.7,3.05 15.24,3.05 17.78,3.05 25.4,5.59 10.16,5.59 7.62,7.75 12.7,28.45 17.78,33.53 17.78,30.99 20.32,33.53 22.86,33.53 25.4,33.53 27.94,33.53 30.48,33.53 33.02,33.53 22.86,30.99 25.4,30.99 27.94,30.99 30.48,30.99 33.02,30.99 35.56,30.99 40.64,33.53 30.48,28.45 27.94,25.91 25.4,26.04 22.86,26.04 37.34,30.61 30.48,20.83 33.02,20.83 30.48,23.37 27.94,23.37 20.32,26.04 20.32,23.88 22.86,23.88 22.86,28.45 17.78,28.96 20.32,28.96 25.4,28.45 7.62,10.67 10.16,33.53 10.16,30.99 5.08,33.53 2.54,28.45 2.54,25.91 45.72,33.53 48.26,33.53 50.8,33.53 53.34,33.53 60.96,33.53 63.5,33.53 58.42,33.53 55.88,23.37 55.88,28.45 53.34,23.37 55.88,30.99 53.34,30.99 53.34,28.45 50.8,30.99 50.8,28.45 50.8,18.29 63.5,13.21 55.88,15.75 53.34,15.75 48.26,13.21 48.26,15.75 58.42,10.67 7.62,15.75 2.54,15.75 45.34,20.83 40.64,20.83 45.72,18.29 60.71,18.29 64.14,18.29 46.74,21.97 22.86,13.21 27.94,28.45 30.48,25.53 27.94,18.29 25.4,18.29 22.86,18.29 20.57,20.83 17.78,20.83
  pour Top (rank 3, no thermals): 66.55,0 21.72,0 21.72,6.1 27.43,6.1 27.43,8.76 24.26,8.76 23.88,8.38 21.46,8.38 21.46,9.4 20.83,9.4 20.7,9.27 20.7,8.38 14.99,8.38 14.99,4.83 19.05,4.83 20.32,6.1 21.59,6.1 21.59,0 3.17,0 arc-90 0,3.17 0,32.89 arc-90 3.05,36.07 66.55,36.07
  pour Route2 (no thermals): 66.55,0 3.17,0 arc-90 0,3.17 0,32.89 arc-90 3.05,36.07 66.55,36.07
  pour Top (isolate 0.127, no thermals): 19.05,8.13 19.05,7.24 15.24,7.24 15.24,5.08 18.92,5.08 20.19,6.35 27.18,6.35 27.18,8.26 25.02,8.26 24.89,8.13 21.21,8.13 21.21,9.02 20.95,9.02 20.95,8.13
ANT
  Top 0.254: U3.LNA 46.25,25.67
  Top 0.305: C8.1 53.72,21.59 arc-90 51.69,23.62 arc90 49.64,25.67 46.25,25.67
CEC_RX
  Top 0.152: U3.GPOIO5 40.29,25.17 40.01,24.89 40.01,23.5 38.61,22.1 34.67,22.1 34.04,21.46 30.35,21.46 29.56,22.25 R12.1 | 25.25,22.23 R12.1 | T1.P$3 24,21.84 24.41,22.25 R12.1
CEC_TX
  Top 0.152: R15.1 28.45,27.81 29.72,29.08 34.42,29.08 36.96,31.62 39.88,31.62 41.68,29.82 U3.GPIO4
FLASH_BOOT  (via drill 0.25)
  Top 0.152: S2.P$2 S2.P$1 | 54.71,7.21 R6.1 54.71,18.01 v54.74,18.03 | v41.4,32.26 41.4,31.11 42.18,30.33 U3.GPIO0
  Top 0.254: 54.71,7.21 S2.P$1
  Bottom 0.152: v54.74,18.03 54.48,17.78 52.2,17.78 51.44,17.02 45.47,17.02 42.16,20.45 42.04,25.27 41.78,25.53 41.78,28.19 42.04,28.45 42.04,30.48 41.4,31.11 v41.4,32.26
HDMI_CEC
  Top 0.152: C17.1 22.89,26.82 21.08,25.02 D2.C 19.3,25.02 19.18,25.15 17.93,25.15 R14.2 15.89,25.67 T2.P$3 10.79,27.05 10.14,26.4 J4.P$13
N$2
  Top 0.152: C4.1 24.54,8.61 24.43,8.71 U2.P$1
N$3
  Top 0.152: R15.2 24.79,27.81 C17.2 24.54,27.56 19.94,27.56 19.33,26.95 R10.2 18.8,26.92 17.97,26.1 T2.P$1
N$4
  Top 0.152: R1.2 11.23,6.48 U1.5
N$5
  Top 0.152: D3.1 22.31,17.18 23.11,16.38 25.11,16.38 R16.1
  Top 0.254: D3.1 22.31,17.36
N$6
  Top 0.152: U2.P$7 21.09,4.48 R2.1 R3.2 C2.1
N$7  (via drill 0.25)
  Top 0.254: R4.2 27.6,14.57 v27.94,14.22 | v14.1,5.21 U1.1
  Top 0.406: R16.2 R4.2
  Bottom 0.254: v27.94,14.22 20.83,14.22 14.1,7.49 v14.1,5.21
N$8
  Top 0.254: D1.2 R4.1
N$9
  pour Top (isolate 0.127, no thermals): 21.72,11.94 21.72,8.51 21.46,8.51 21.46,9.14 20.83,9.78 20.83,11.94
N$10
  Top 0.152: U3.RES12K 44.68,23.77 44.96,23.5 47.15,23.5 R5.2
N$11
  Top 0.152: U3.XTAL_IN 43.18,21.08 43.77,20.49 X1.P$3 44.12,19.81 C6.1
N$12
  Top 0.152: U3.XTAL_OUT 42.68,18.81 41.74,17.87 X1.P$1 41.23,17.53 39.75,17.53 39.72,17.5 C7.2
N$15
  Top 0.152: R8.2 18.88,21.59 T1.P$2
N$16
  Top 0.152: R14.1 R9.2 19.25,23.11 T1.P$1
N$18
  Top 0.152: R13.2 23.49,25.25 D2.A
N$20
  Top 0.152: U3.SD_CLK 39.63,26.67 39.24,26.29 39.24,23.75 38.48,22.99 36.07,22.99 34.67,24.38 34.67,26.42 34.29,26.8 U4.P$6
N$21
  Top 0.152: U4.P$1 35.94,24.26 35.43,24.77 35.43,28.45 35.94,28.96 38.73,28.96 39.24,28.45 39.24,28.07 40.13,27.18 U3.SD_CMD
N$22
  Top 0.152: U3.SD_DATA_1 40.02,25.67 39.62,25.27 39.62,23.62 38.61,22.61 35.94,22.61 33.66,24.89 31.37,24.89 31.11,25.15 31.11,25.78 30.86,26.04 30.86,27.81 31.11,28.07 U4.P$5
N$23  (via drill 0.25)
  Top 0.152: U4.P$2 v35.94,25.53 | v39.75,26.16 U3.SD_DATA_0
  Bottom 0.152: v35.94,25.53 39.12,25.53 v39.75,26.16
N$24
  Top 0.152: U3.SD_DATA_3 40.27,27.67 39.62,28.32 39.62,28.7 38.99,29.34 35.81,29.34 35.05,28.57 35.05,24.51 36.2,23.37 38.35,23.37 38.86,23.88 38.86,26.42 38.48,26.8 U4.P$3
N$25
  Top 0.152: U3.SD_DATA_2 40.28,28.17 40.01,28.45 40.01,28.96 39.24,29.72 35.69,29.72 34.67,28.7 34.67,27.81 34.29,27.43 31.5,27.43 31.24,27.18 31.24,26.16 31.88,25.53 U4.P$7
N$26
  Top 0.254: 66.27,21.66 C8.2
  Top 0.305: ANT1.FEED 66.27,21.66
N$27
  Top 0.152: T2.P$2 19.14,28 R11.2
TCK  (via drill 0.25)
  Top 0.152: U3.MTCK 43.68,30.09 43.94,30.35 43.94,32.13 44.32,32.51 52.45,32.51 v53.09,31.88
  Bottom 0.152: v53.09,31.88 52.7,31.5 52.7,30.48 J3.4
TDI
  Top 0.152: U3.MTDI 44.68,29.95 45.21,30.48 54.23,30.48 J3.8
TDO
  Top 0.152: U3.MTDO 43.18,30.1 43.56,30.48 43.56,32.26 44.2,32.89 54.48,32.89 55.37,33.78 56.64,33.78 57.28,33.15 57.28,30.99 J3.6
TMS
  Top 0.152: U3.MTMS 45.18,29.94 45.34,30.1 52.45,30.1 54.48,28.07 54.48,26.16 J3.2
UART_RX
  Top 0.152: U3.U0RXD 41.68,23.78 39.62,21.72 37.47,21.72 36.32,20.57 36.32,15.11 J5.1
UART_TX
  Top 0.152: U3.U0TXD 42.18,23.64 39.88,21.34 37.59,21.34 36.96,20.7 36.96,16 37.59,15.37 37.59,12.95 36.58,11.94 J5.2
VBAT  (via drill 0.25)
  Top 0.152: U2.P$6 20.11,5.76 v19.81,5.46 19.81,4.57 19.97,4.42 R2.2 | U2.P$8 21.59,4.95 v21.97,4.57
  Top 1.016: J2.1 29.21,10.16 27.81,11.56
  Bottom 0.152: v21.97,4.57 20.7,4.57 v19.81,5.46 v19.81,9.02
  pour Top (rank 2, no thermals): 13.59,8.13 13.59,10.03 15.88,12.32 18.41,12.32 19.56,13.46 21.84,13.46 22.99,12.32 27.69,12.32 28.7,11.3 28.07,10.67 27.43,11.3 22.73,11.3 21.46,12.57 20.83,12.57 20.57,12.32 20.57,9.65 20.7,9.53 20.7,8.51 arc-90 20.57,8.38 20.32,8.13
VBUS  (via drill 0.25)
  Top 0.152: TP1.S v8,5.59
  Top 0.254: D1.1 v21.34,15.49 | 9.02,9.02 v9.02,9.4 9.02,8.41
  Top 0.406: J1.1 6.68,7.7 7.4,8.41 9.02,8.41 11.27,8.41 U1.4
  Bottom 0.152: v9.02,9.4 9.02,6.48 v8,5.59
  Bottom 0.254: v9.02,9.4 15.24,9.4 v21.34,15.49

### Text on the board
tNames: CEC | CHRG | FULL | PWR | MCU | +3V3 | VBAT | VBUS | +
bNames: WiFi-CEC Bridge / rev A / Nuclear Furnace, 2017